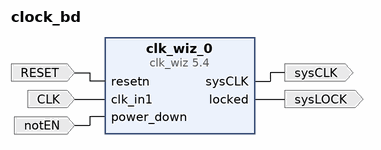
[diagram p0: block diagram of the top level]
# Vivado block design clock_bd, xc7a35tcpg236-1, Vivado 2017.1
create_bd_design clock_bd

create_bd_port -dir I -type rst RESET
create_bd_port -dir I -type clk CLK
create_bd_port -dir I notEN
create_bd_port -dir O sysLOCK
create_bd_port -dir O -type clk sysCLK
set_property -dict {CONFIG.FREQ_HZ 168000000} [get_bd_ports sysCLK]

create_bd_cell -type ip -vlnv xilinx.com:ip:clk_wiz:5.4 clk_wiz_0
set_property -dict [list \
  CONFIG.CLKOUT2_USED false \
  CONFIG.NUM_OUT_CLKS 1 \
  CONFIG.CLK_OUT1_PORT sysCLK \
  CONFIG.CLK_OUT2_PORT clk_out2 \
  CONFIG.CLKOUT1_REQUESTED_OUT_FREQ 168.000 \
  CONFIG.CLKOUT2_REQUESTED_OUT_FREQ 100.000 \
  CONFIG.CLKOUT2_REQUESTED_PHASE 0.000 \
  CONFIG.USE_POWER_DOWN true \
  CONFIG.RESET_PORT resetn \
  CONFIG.MMCM_DIVCLK_DIVIDE 1 \
  CONFIG.MMCM_CLKFBOUT_MULT_F 10.500 \
  CONFIG.MMCM_CLKOUT0_DIVIDE_F 6.250 \
  CONFIG.MMCM_CLKOUT1_DIVIDE 1 \
  CONFIG.MMCM_CLKOUT1_PHASE 0.000 \
  CONFIG.RESET_TYPE ACTIVE_LOW \
  CONFIG.CLKOUT1_JITTER 114.381 \
  CONFIG.CLKOUT1_PHASE_ERROR 94.994 \
  CONFIG.CLKOUT2_JITTER 265.458 \
  CONFIG.CLKOUT2_PHASE_ERROR 310.955 \
] [get_bd_cells clk_wiz_0]

# ---- connections ----

connect_bd_net -net resetn_1 [get_bd_ports RESET] [get_bd_pins clk_wiz_0/resetn]
connect_bd_net -net clk_in1_1 [get_bd_ports CLK] [get_bd_pins clk_wiz_0/clk_in1]
connect_bd_net -net power_down_1 [get_bd_ports notEN] [get_bd_pins clk_wiz_0/power_down]
connect_bd_net [get_bd_pins clk_wiz_0/locked] [get_bd_ports sysLOCK]
connect_bd_net [get_bd_pins clk_wiz_0/sysCLK] [get_bd_ports sysCLK]

validate_bd_design
save_bd_design
